# Altium schematic sheet SoundGenerator.SchDoc
size A; Organization: Altium Limited; Address1: L3, 12a Rodborough Rd; Address2: Frenchs Forest; Address3: NSW; Address4: Australia 2086; DocumentNumber: 3; SheetNumber: 3; SheetTotal: 8
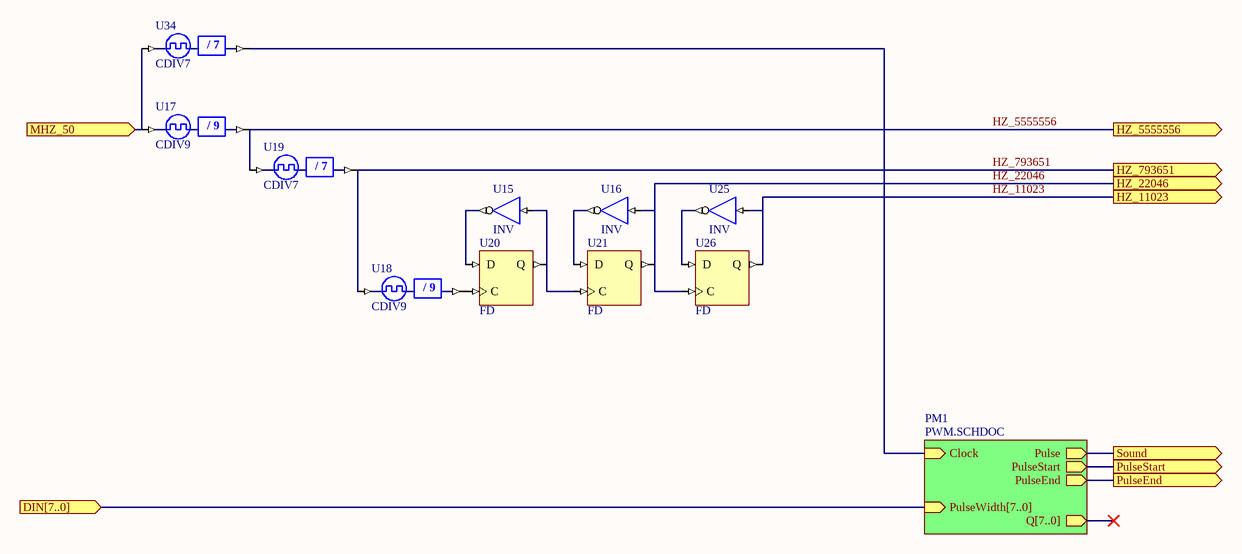
[diagram p0: SoundGenerator.SchDoc]

## Parts
U15  INV
U16  INV
U17  CDIV9
U18  CDIV9
U19  CDIV7
U20  FD
U21  FD
U25  INV
U26  FD
U34  CDIV7

## Sub-sheets
PM1 = PWM.SCHDOC: Clock (in), PulseWidth[7..0] (in), Pulse (out), Q[7..0] (out), PulseEnd (out), PulseStart (out)

## Ports
DIN[7..0] (in), HZ_11023 (out), HZ_22046 (out), HZ_793651 (out), HZ_5555556 (out), MHZ_50 (in), PulseEnd (out), PulseStart (out), Sound (out)

## Nets
HZ_11023: U25.I U26.Q ; port HZ_11023
HZ_22046: U16.I U21.Q U26.C ; port HZ_22046
HZ_793651: U18.CLKIN U19.CLKDV ; port HZ_793651
HZ_5555556: U17.CLKDV U19.CLKIN ; port HZ_5555556
MHZ_50: U17.CLKIN U34.CLKIN ; port MHZ_50
PulseEnd: port PulseEnd, sheet PM1/PulseEnd
PulseStart: port PulseStart, sheet PM1/PulseStart
Sound: port Sound, sheet PM1/Pulse
NetU15_I: U15.I U20.Q U21.C
NetU15_O: U15.O U20.D
NetU16_O: U16.O U21.D
NetU18_CLKDV: U18.CLKDV U20.C
NetU25_O: U25.O U26.D
NetU34_CLKDV: U34.CLKDV ; sheet PM1/Clock

## Buses and harness runs
bus port DIN[7..0] = sheet PM1/PulseWidth[7..0]

## Notes on the sheet
- The data should be updated at the Amplidtude input at a rate of 22050 HZ
  Our "rough" clock is 22046 HZ
  We monitor this line and every time to goes high we load a new data byte from the internal FIFO onto the amplitude.
  Since the MCU is running at 50MHz which is 12.5 MIPS, we can get approx 550 instructions per required data sample.
- Title
- Size:
- Date:
- A
- Number:
- Time:
- Revision:
- Sheet
- of
- File:
- (in symbol CDIV7) / 7
- (in symbol CDIV9) / 9

## Library data of the parts
U15 U16 U25 = INV: Inverter; ArchiveName: GENERIC; Published: 18-Nov-2003; Publisher: Altium Limited; Xilinx Equivalent: INV; Core Revision: 1.00.00
U17 U18 = CDIV9: Clock Divider by 9; ArchiveName: GENERIC; Published: 18-Dec-2003; Publisher: Altium Limited; Core Revision: 1.00.00
U19 U34 = CDIV7: Clock Divider by 7; ArchiveName: GENERIC; Published: 18-Dec-2003; Publisher: Altium Limited; Core Revision: 1.00.00
U20 U21 U26 = FD: D-Type Flip-Flop; ArchiveName: GENERIC; Published: 18-Nov-2003; Publisher: Altium Limited; Xilinx Equivalent: FD; Core Revision: 1.00.00